# Altium schematic sheet FTDIUSB.SchDoc: FTDI USB
size A; Author: Craig Hesling; DrawnBy: Craig Hesling; Revision: 3
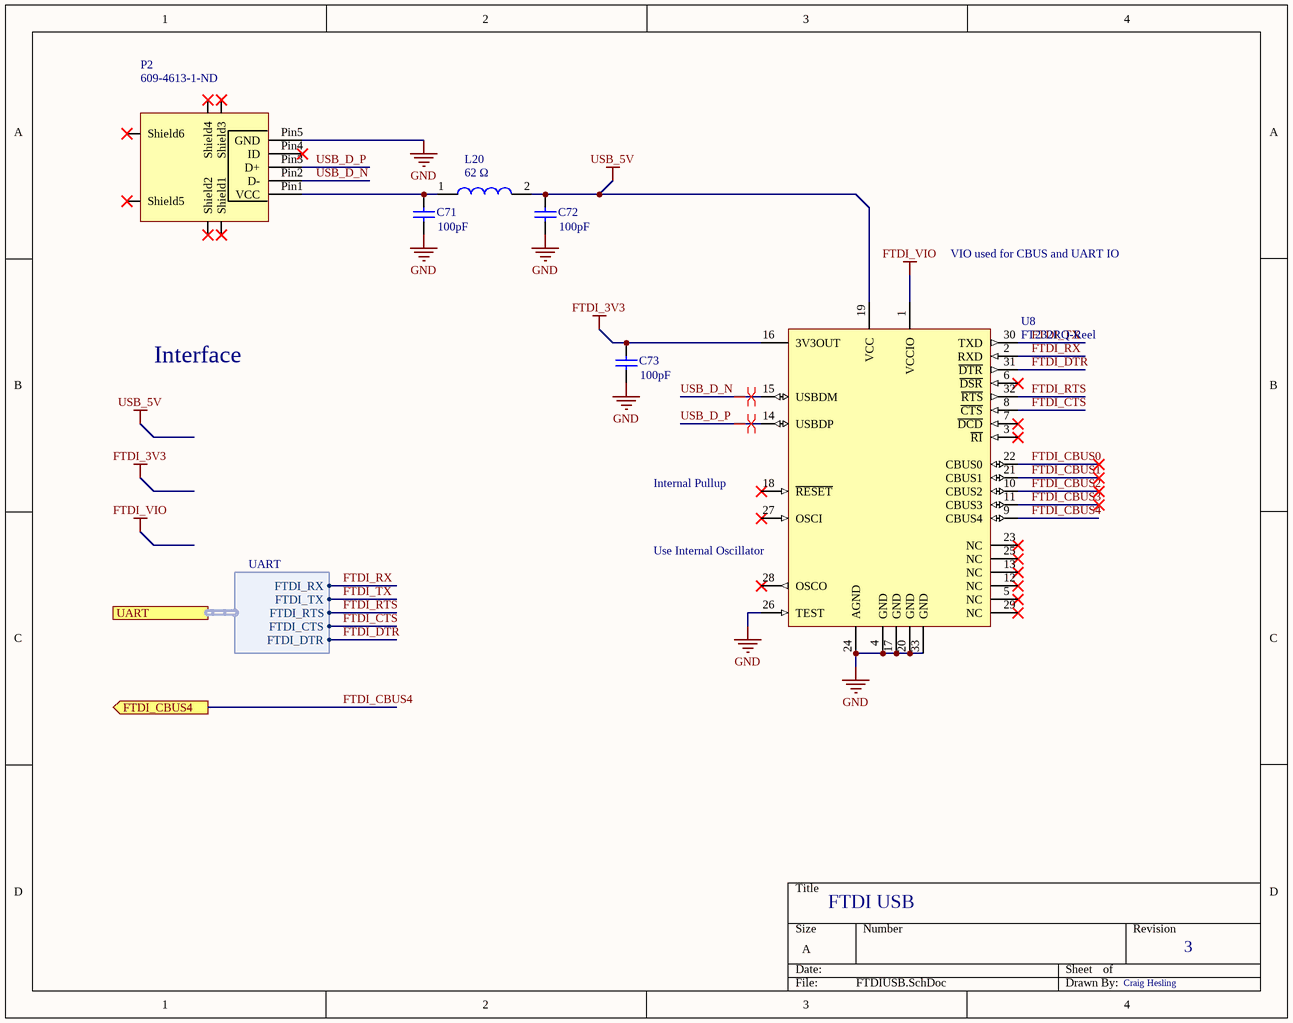
[diagram p0: FTDIUSB.SchDoc]

## Parts
C71  value 100pF  [CAPC0603(1608)100_N]  (hidden comment: Cap Semi)
C72  value 100pF  [CAPC0603(1608)100_N]  (hidden comment: Cap Semi)
C73  value 100pF  [CAPC0603(1608)100_N]  (hidden comment: Cap Semi)
L20  62 Ω  [WE-CBA_0603_HC]
P2  Supplier Part Number 1: 609-4613-1-ND  [MicroUSB_TypeB]  (hidden comment: Micro USB Type-B)
U8  FT232RQ-Reel  [PQFN5X5-32_V_FTDI_BIG_VIAS]

## Ports
FTDI_CBUS4 (out), UART (harness UART)

## Harnesses
UART: FTDI_RX, FTDI_TX, FTDI_DTR, FTDI_CTS, FTDI_RTS

## Nets
FTDI_3V3: C73.2 U8.16(3V3OUT)
FTDI_VIO: U8.1(VCCIO)
GND: C71.1 C72.1 C73.1 P2.Pin5(GND) U8.4(GND) U8.17(GND) U8.20(GND) U8.24(AGND) U8.26(TEST) U8.33(GND)
USB_5V: C72.2 L20.2 U8.19(VCC)
FTDI_CBUS0: U8.22(CBUS0)
FTDI_CBUS1: U8.21(CBUS1)
FTDI_CBUS2: U8.10(CBUS2)
FTDI_CBUS3: U8.11(CBUS3)
FTDI_CBUS4: U8.9(CBUS4) ; port FTDI_CBUS4
FTDI_CTS: U8.8(~{CTS}) ; port UART.FTDI_CTS
FTDI_DTR: U8.31(~{DTR}) ; port UART.FTDI_DTR
FTDI_RTS: U8.32(~{RTS}) ; port UART.FTDI_RTS
FTDI_RX: U8.2(RXD) ; port UART.FTDI_RX
FTDI_TX: U8.30(TXD) ; port UART.FTDI_TX
USB_D_N: P2.Pin2(D-) U8.15(USBDM)
USB_D_P: P2.Pin3(D+) U8.14(USBDP)
NetC71_2: C71.2 L20.1 P2.Pin1(VCC)

Not connected (* = marked no-connect by the designer): P2 Pin4(ID)* Shield1* Shield2* Shield3* Shield4* Shield5* Shield6*; U8 3(~{RI})* 5(NC)* 6(~{DSR})* 7(~{DCD})* 12(NC)* 13(NC)* 18(~{RESET})* 23(NC)* 25(NC)* 27(OSCI)* 28(OSCO)* 29(NC)*

## Layout directives
differential pair: USB_D_N, USB_D_P

## Notes on the sheet
- VIO used for CBUS and UART IO
- Interface
- (near U8) Internal Pullup
- (near U8) Use Internal Oscillator

## Library data of the parts
C71-C73 = Cap Semi: Capacitor (Semiconductor SIM Model); Published: 8-Jun-2000; LatestRevisionDate: 29-May-2009; LatestRevisionNote: IPC-7351 Footprint Added.; PackageReference: C1206; Publisher: Altium Limited; PackageDescription: Chip Capacitor
L20 = WE-CBA 0603,  782633620: WE-CBA SMD EMI Suppression Ferrite Bead, Impedance = 62 Ω, High Current; Manufacturer: Wurth Elektronik; partNo: 782633620; Impedance: 62 Ω; ComponentLink1Description: Manufacturer; ComponentLink1URL: http://www.we-online.de; Created by: Baojun Chen; Created Date: Nov.2015; ComponentLink2Description: Datasheet; ComponentLink2URL: http://katalog.we-online.de/pbs/datasheet/782633620.pdf; Supplier 1: Digi-Key; Supplier Part Number 1: 732-6702-1-ND
P2 = MicroUSB TypeB: Micro USB Type B Port; Supplier: http://www.digikey.com/product-detail/en/amphenol-fci/10118192-0001LF/609-4613-2-ND/2785387; Datasheet: http://portal.fciconnect.com/Comergent//fci/drawing/10118192.pdf; Supplier 1: Digi-Key
U8 = FT232RQ-Reel: USB UART Asynchronous Serial Data Transfer Chip, 32-pin QFN, Tape and Reel; Manufacturer: FTDI; DatasheetVersion: ver 2.10, Mar-2012; PackageVersion: Mar-12; PackageReference: PQFN5X5-32; PackageDescription: 32-Pin Quad Flat No-Lead 0.5 mm Pitch, Pullback, 3.2 x 3.2 mm Exposed Pad; PartNumber: FT232RQ-Reel; ComponentLink1Description: Manufacturer URL; ComponentLink1URL: http://www.ftdichip.com/; ComponentLink2Description: Datasheet; ComponentLink2URL: http://www.ftdichip.com/Support/Documents/DataSheets/ICs/DS_FT232R.pdf